# Altium schematic sheet Power_Supply_Input.SchDoc
size A4; CompanyName: Technische Hochschule Nürnberg Georg Simon Ohm; Organization: UltraZohm; Address1: Kesslerplatz 12; Address2: 90489 Nürnberg; Address3: GERMANY; SheetNumber: 23; Website: www.ultrazohm.com
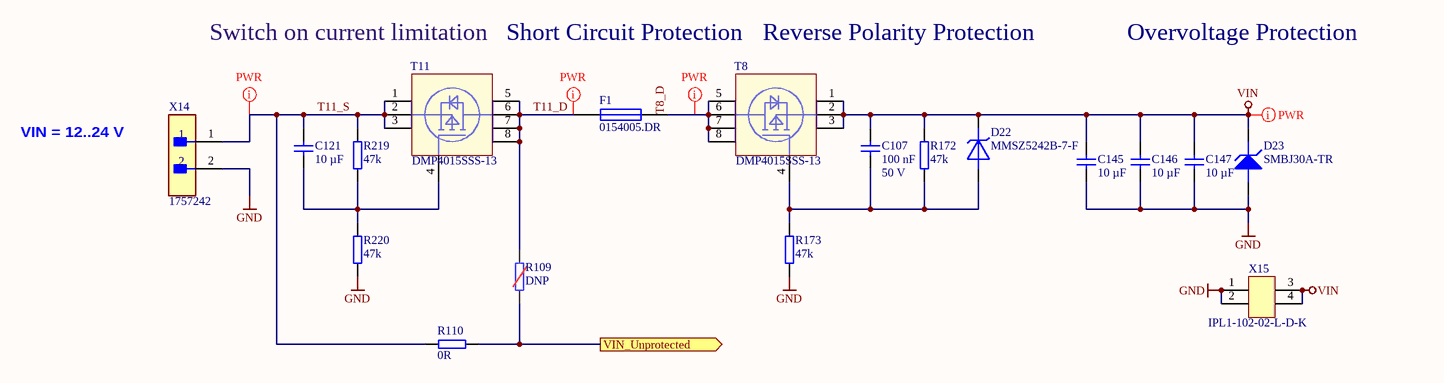
[diagram p0: Power_Supply_Input.SchDoc]

## Parts
C107  100 nF  Voltage: 50 V  [C_0603_TE]
C121  10 µF  [C_1206_TE]
C145  10 µF  [C_1206_TE]
C146  10 µF  [C_1206_TE]
C147  10 µF  [C_1206_TE]
D22  MMSZ5242B-7-F  [DIOM5226X240N]
D23  SMBJ30A-TR  [DIOM5436X244N]
F1  0154005.DR  [Littlefuse_154]
R109  DNP  [R_1206_TE-DNP]  (no BOM)
R110  0R  [R_1206_TE]
R172  47k  [R_0603_TE]
R173  47k  [R_0603_TE]
R219  47k  [R_0603_TE]
R220  47k  [R_0603_TE]
T8  DMP4015SSS-13  [SOIC127P600X175-8N]
T11  DMP4015SSS-13  [SOIC127P600X175-8N]
X14  1757242  [1757242]
X15  IPL1-102-02-L-D-K  [IPL1-102-02-L-D-K]

## Ports
VIN_Unprotected (out)

## Nets
GND: C145.1 C146.1 C147.1 D23.2(ANODE) R173.1 R220.1 X14.2 X15.1 X15.2
VIN: C107.1 C145.2 C146.2 C147.2 D22.2(K) D23.1(KATHODE) R172.2 T8.1(SOURCE) T8.2(SOURCE) T8.3(SOURCE) X15.3 X15.4
T8_D: F1.2 T8.5(DRAIN) T8.6(DRAIN) T8.7(DRAIN) T8.8(DRAIN)
T11_D: F1.1 R109.2 T11.5(DRAIN) T11.6(DRAIN) T11.7(DRAIN) T11.8(DRAIN)
T11_S: C121.1 R110.1 R219.2 T11.1(SOURCE) T11.2(SOURCE) T11.3(SOURCE) X14.1
VIN_Unprotected: R109.1 R110.2 ; port VIN_Unprotected
NetC107_2: C107.2 D22.1(A) R172.1 R173.2 T8.4(GATE)
NetC121_2: C121.2 R219.1 R220.2 T11.4(GATE)

## Layout directives
net class PWR: T8_D, T11_D, T11_S, VIN

## Notes on the sheet
- Switch on current limitation
- Short Circuit Protection
- Reverse Polarity Protection
- Overvoltage Protection
- VIN = 12..24 V
- Title
- Revision:
- Design Engineer:
- Date:
- Project:
- Sheet
- of

## Library data of the parts
C107 = UZgen_C_0603_100nF_50V_X7R: Generic capacitor; Manufacturer: UZgen; Tolerance: 10 %; Created from: AGeiger; Value: 100 nF; Technology: X7R; Manufacturer Part Number: UZgen_C_0603_100nF_50V_X7R; PartID: 1; Created On: 02/07/2024 14:42:23; Device Package: 0603; Mounting Type: SMD; Last Updated: 02/08/2024 14:45:57
C121 C145-C147 = UZgen_C_1206_10uF_50V_X7R: Generic capacitor; Manufacturer: UZgen; Tolerance: 10 %; Created from: MGeier; Voltage: 50V; Value: 10 µF; Manufacturer Part Number: UZgen_C_1206_10uF_50V_X7R; PartID: 5807; Created On: 20/03/2025 14:05:00; Device Package: 1206; Last Updated: 20/03/2025 14:05:00; Mounting Type: SMD; Technology: X7R
D22 = MMSZ5242B-7-F: Zener Diode, 12V, 500 mW; Manufacturer: Diodes Incorporated; Power: 0.5W; Power Loss: 500mW; Zener Impedance: 30 Ohm; Created from: MGremer; Category: zener; Manufacturer Part Number: MMSZ5242B-7-F; Package: SOD-123; Supplier: Mouser; Supplier Part Number 1: 621-MMSZ5242B-F; Mounting Style: SMT; Pins: 2; Voltage: 12V; PartID: 3; Created On: 06/01/2021 09:28:59; ComponentLink1Description: Datasheet; ComponentLink1URL: https://www.mouser.de/datasheet/2/115/DIOD_S_A0003550771_1-2542306.pdf; Component Type: Zener Diode; Device Package: SOD-123-2; Last Updated: 11/07/2024 09:34:11; Mounting Type: SMD; Operating Temperature: -65 - 150 °C; Series: MMSZ524; Supplier 1: Mouser; Type: Zener Diode; Value: 12V; Live Cycle Status: 1; Stock number: not stored; LCSC Part Number: C500776
D23 = SMBJ30A-TR: TVS Diode 30V 600W SMB unidirectional / ESD suppressor; Manufacturer: STMicroelectronics; Type: TVS-Diode; Created from: PBaumann; Manufacturer Part Number: SMBJ30A-TR; PartID: 19; Created On: 05/03/2021 11:12:07; ComponentLink1Description: Datasheet; ComponentLink1URL: https://www.st.com/resource/en/datasheet/smbj30a.pdf; Component Type: TVS Diode; Device Package: DO-214AA-2; Last Updated: 23/07/2025 19:13:45; Mounting Type: SMD; Operating Temperature: -55 - 150°C; Series: SMBJxxA; Supplier 1: LCSC; Supplier Part Number 1: C133663; Value: 30V; Live Cycle Status: 1; LCSC Part Number: C133663
F1 = 0154005.DR: Fuse OMNI BLOK 154; Manufacturer: Littlefuse; Nominal current: 5 A; Nominal voltage AC: 125 VAC; Nominal voltage DC: 125 VDC; Resistance: 12.5 mOhm; Value: 5 A; Created from: MGremer; Manufacturer Part Number: 0154005.DR; PartID: 1; Created On: 07/01/2021 10:17:19; ComponentLink1Description: Datasheet; ComponentLink1URL: https://www.mouser.de/datasheet/2/240/Littelfuse_Fuse_154_154T_154L_154TL_Datasheet_pdf-365375.pdf; Component Type: NAN02 - 154 OMNI-BLOK; Device Package: OMNI-BLOK; Last Updated: 04/09/2024 15:44:00; Mounting Type: SMD; Operating Temperature: -55 - 125 °C; Series: 154; Supplier 1: Mouser; Supplier Part Number 1: 576-0154005.DR; Type: Fuse; Live Cycle Status: 1; Supplier 2: LCSC; Supplier Part Number 2: C206916; LCSC Part Number: C206916
R109 = UZgen_R_1206_DNP: Generic resistor (DNP); Manufacturer: UZgen; Created from: UZgenTool; Manufacturer Part Number: UZgen_R_1206_DNP; PartID: 595; Created On: 25/03/2025 14:26:15; Value: DNP; Device Package: 1206; Tolerance: -; Mounting Type: SMD; Last Updated: 02/04/2025 19:05:00
R110 = UZgen_R_1206_0R: Generic resistor; Manufacturer: UZgen; Tolerance: 1 %; Created from: UZgenTool; Manufacturer Part Number: UZgen_R_1206_0R; PartID: 583; Created On: 08/07/2024 14:34:30; Value: 0R; Device Package: 1206; Mounting Type: SMD; Last Updated: 08/07/2024 14:34:30
R172 R173 R219 R220 = UZgen_R_0603_47k: Generic resistor; Manufacturer: UZgen; Tolerance: 1 %; Created from: UZgenTool; Value: 47k; Manufacturer Part Number: UZgen_R_0603_47k; PartID: 260; Created On: 02.07.2024 17:29:50; Device Package: 0603; Mounting Type: SMD; Last Updated: 02.07.2024 17:29:50
T8 T11 = DMP4015SSS-13: MOSFET MOSFET BVDSS: 41V-60 1V-60V SO-8 T&R 2.5K; Manufacturer: Diodes Incorporated; Type: P-Channel Power MOSFET; Number Of Channels: 1; Drain Source Voltage: 40 V; Drain DC Current: 10.1 A; RDS On Resistance: 11 mOhm; Power Dissipation: 1.82 W; Value: 40 V; Created from: FRosner; Manufacturer Part Number: DMP4015SSS-13; PartID: 2; Created On: 28.06.2024 09:26:52; ComponentLink1Description: Datasheet; ComponentLink1URL: https://www.diodes.com/assets/Datasheets/DMP4015SSS.pdf; Component Type: MOSFET SO-8; Device Package: SOIC-8; Last Updated: 09.07.2024 20:11:46; Mounting Type: SMD; Operating Temperature: -55 - 150 °C; Series: DMP40; Supplier 1: Mouser; Supplier Part Number 1: 621-DMP4015SSS-13; Supplier 2: LCSC; Supplier Part Number 2: C508210; Live Cycle Status: 1; LCSC Part Number: C508210
X14 = 1757242: Pluggable Terminal Blocks 2 Pos 5.08mm pitch Through Hole Header; Manufacturer: Phoenix Contact; Created from: FRosner; Number of positions: 2; Manufacturer Part Number: 1757242; PartID: 58; Created On: 20/04/2023 12:39:10; ComponentLink1Description: Datasheet; ComponentLink1URL: https://wmsc.lcsc.com/wmsc/upload/file/pdf/v2/lcsc/1811051310_Phoenix-Contact-1757242_C90074.pdf; Component Type: Phoenix Connector; Device Package: Connector; Last Updated: 04/07/2024 08:41:38; Mounting Type: THT; Operating Temperature: -40 - 100  °C; Supplier 1: Mouser; Supplier Part Number 1: 651-1757242; Supplier 2: LCSC; Supplier Part Number 2: C90074; Type: Connector; Live Cycle Status: 1; Number of rows: 1; LCSC Part Number: C90074; Stock number: not stored
X15 = 30759: AN: 30759; Mixed: SMT; H-ART: IPL1-102-02-L-D-K-TR; Temperature-Range: -55/+125; Extra: Connector Header IPL1, 2-row 4pos, key polarization, SMT 0°; Case: IPL1; HelpURL: b:\AD\adlib\datasheet\Samtec\IPL1-SMT\